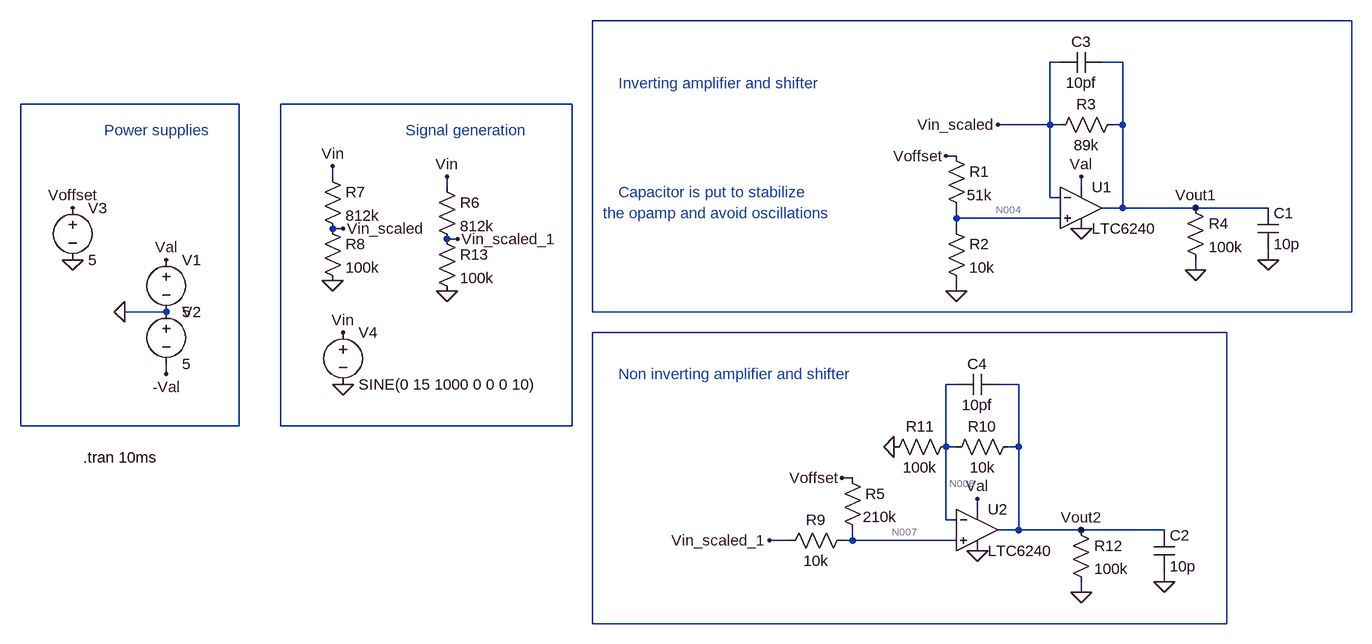
[diagram p0: schematic One_OpAmp.asc]
* One_OpAmp.asc
V1 Val 0 5
R1 Voffset N004 51k
R2 N004 0 10k
R3 Vout1 Vin_scaled 89k
V3 Voffset 0 5
V4 Vin 0 SINE(0 15 1000 0 0 0 10)
R7 Vin Vin_scaled 812k
R8 Vin_scaled 0 100k
R4 Vout1 0 100k
C1 Vout1 0 10p
V2 0 -Val 5
* U1: LTC6240 (symbol Opamps\LTC6240 not available, pins judged from their places): In+=N004 In-=Vin_scaled V+=Val V-=0 OUT=Vout1
C3 Vout1 Vin_scaled 10pf
R5 Voffset N007 210k
R9 N007 Vin_scaled_1 10k
R10 Vout2 N006 10k
R11 N006 0 100k
R12 Vout2 0 100k
C2 Vout2 0 10p
* U2: LTC6240 (symbol Opamps\LTC6240 not available, pins judged from their places): In+=N007 In-=N006 V+=Val V-=0 OUT=Vout2
C4 Vout2 N006 10pf
R6 Vin Vin_scaled_1 812k
R13 Vin_scaled_1 0 100k
* Signal generation
.tran 10ms
* Power supplies
* Inverting amplifier and shifter
* Non inverting amplifier and shifter
* Capacitor is put to stabilize
* the opamp and avoid oscillations
.backanno
.end

* Results of the author's LTspice run, read from the files saved beside the schematic
* Operating Point, zero values left out:
*   V(val) = 5 V
*   V(voffset) = 5 V
*   V(n004) = 819.7 mV
*   V(vout1) = 1.639 V
*   V(vin_scaled) = 819.7 mV
*   V(-val) = -5 V
*   V(n007) = 1.602 V
*   V(vin_scaled_1) = 1.441 V
*   V(vout2) = 1.763 V
*   V(n006) = 1.602 V
*   I(R13) = 14.41 µA
*   I(R6) = -1.774 µA
*   I(R12) = 17.63 µA
*   I(R11) = 16.02 µA
*   I(R10) = 16.02 µA
*   I(R9) = 16.18 µA
*   I(R5) = 16.18 µA
*   I(R4) = 16.39 µA
*   I(R8) = 8.197 µA
*   I(R7) = -1.009 µA
*   I(R3) = 9.206 µA
*   I(R2) = 81.97 µA
*   I(R1) = 81.97 µA
*   I(V4) = 2.784 µA
*   I(V3) = -98.15 µA
*   I(V1) = -3.629 mA
*   Ix(u1:1) = -4.237 pA
*   Ix(u1:2) = -4.237 pA
*   Ix(u1:3) = 1.813 mA
*   Ix(u1:4) = -1.787 mA
*   Ix(u1:5) = -25.6 µA
*   Ix(u2:1) = -2.358 pA
*   Ix(u2:2) = -2.358 pA
*   Ix(u2:3) = 1.816 mA
*   Ix(u2:4) = -1.783 mA
*   Ix(u2:5) = -33.65 µA
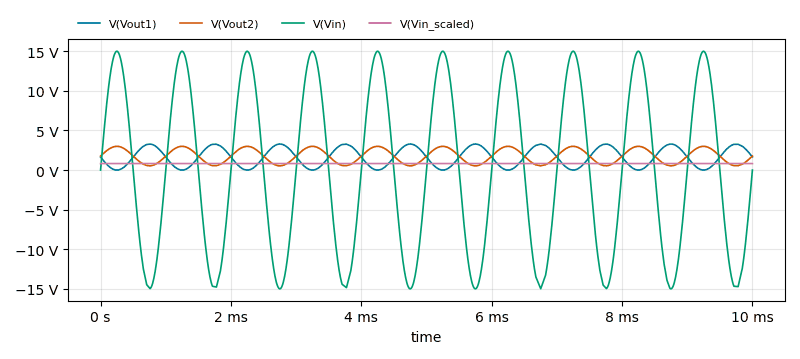
[diagram p1: Transient Analysis of One_OpAmp.asc, plotted from the saved traces]
* Transient Analysis, 1 run:
*   V(Vout1): min 214.8 µV, max 3.283 V, average 1.637 V, rms 2.007 V, last 1.648 V
*   V(Vout2): min 533.4 mV, max 2.992 V, average 1.764 V, rms 1.966 V, last 1.761 V
*   V(Vin): min -15 V, max 15 V, average 16.23 mV, rms 10.59 V, last 0 V
*   V(Vin_scaled): min 813 mV, max 822.2 mV, average 819.7 mV, rms 819.7 mV, last 819.8 mV